# Altium schematic sheet Power Supplies.SchDoc: Power Supplies
size 431 x 279 mm; DrawnBy: DD; DocumentNumber: GHL-1-21002; Revision: C; SheetNumber: 5; SheetTotal: 7; ProjectID: 263-03
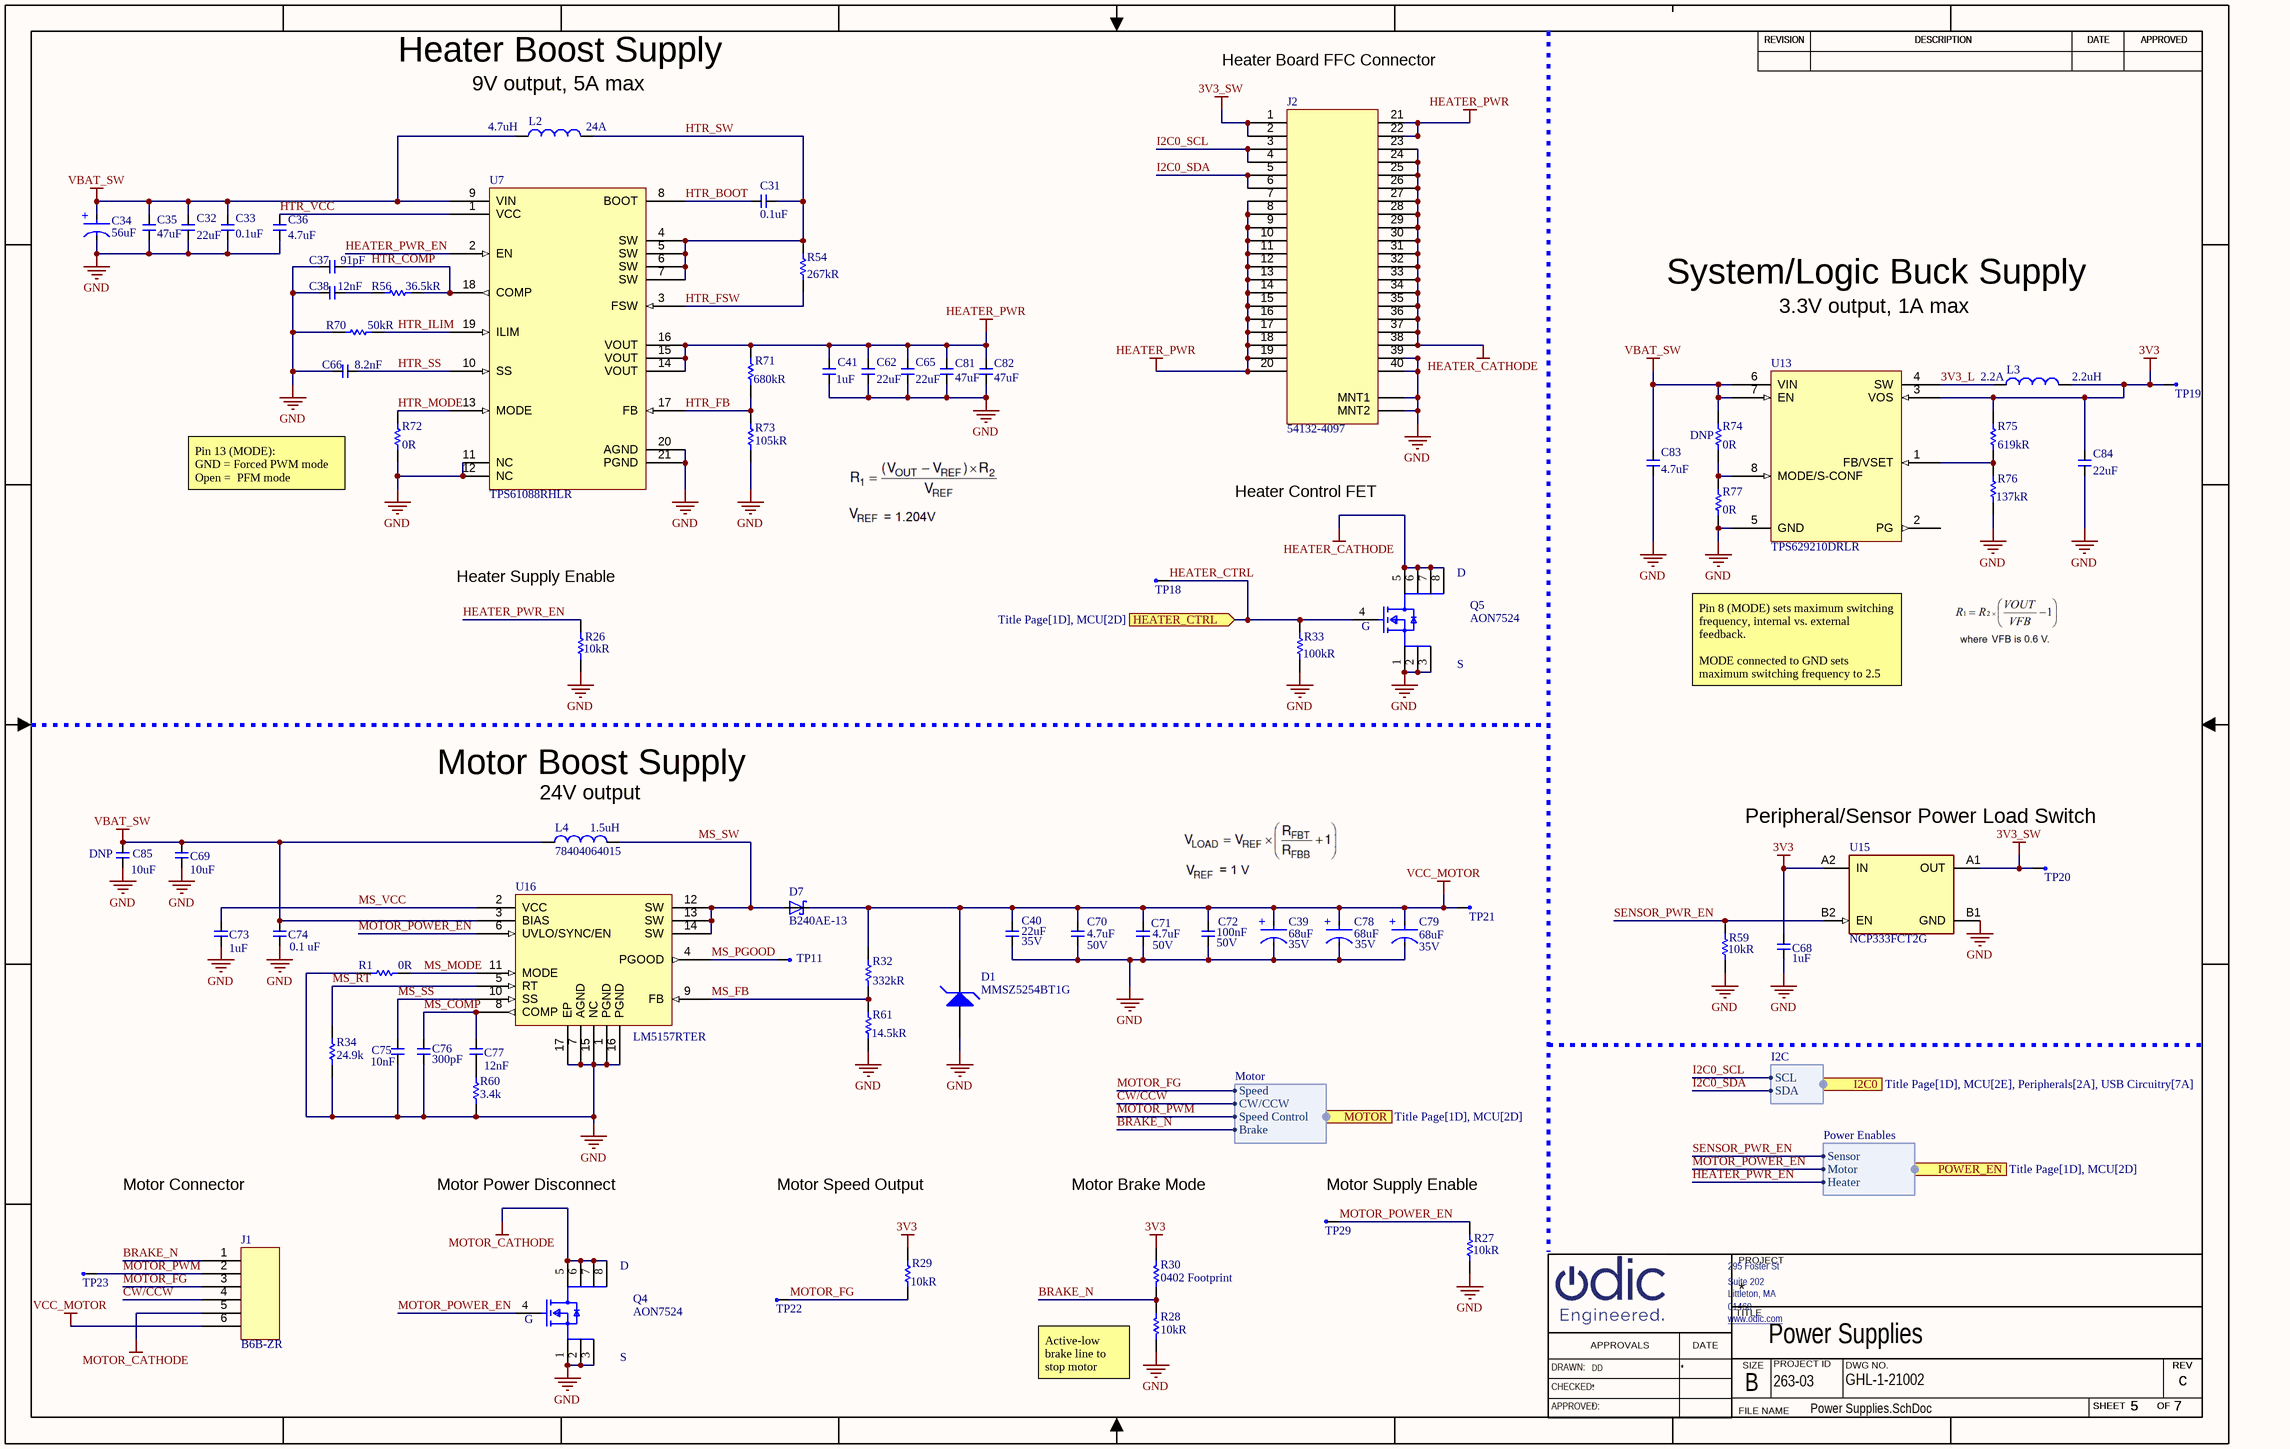
[diagram p0: Power Supplies.SchDoc]

## Parts
C31  0.1uF  [C0402]
C32  value 22uF  [C1206]  (hidden comment: C1206_22u_16C_10pct)
C33  0.1uF  [C0402]
C34  value 56uF  [cap_panasonic_svpf_code-b6]  (hidden comment: 20SVPF56MX)
C35  value 47uF  [C1210]  (hidden comment: C1210_47u_16V_10pct)
C36  4.7uF  [C0402]
C37  value 91pF  [C0402]  (hidden comment: C0402_91p_50V_5pct)
C38  value 12nF  [C0402]  (hidden comment: C0402_12n_16V_10pct)
C39  value 68uF  Voltage Rating: 35V  [C7361-38]  (hidden comment: TAJV686M035RNJ)
C40  value 22uF  Voltage Rating: 35V  [c0805]  (hidden comment: C0805_22u_35V_20pct)
C41  Capacitance: 1uF  [C0603]  (hidden comment: C0603_1u_25V_10pct)
C62  value 22uF  [C1206]  (hidden comment: C1206_22u_16C_10pct)
C65  value 22uF  [C1206]  (hidden comment: C1206_22u_16C_10pct)
C66  value 8.2nF  [C0402]  (hidden comment: C0402_8n2_16V_10pct)
C68  Capacitance: 1uF  [C0402]  (hidden comment: C0402_1u_6V3_10pct)
C69  10uF  [C0603]
C70  value 4.7uF  Voltage Rating: 50V  [c0805]  (hidden comment: C0805_4u7_50V_10pct)
C71  value 4.7uF  Voltage Rating: 50V  [c0805]  (hidden comment: C0805_4u7_50V_10pct)
C72  100nF  Voltage Rating: 50V  [C0603]
C73  1uF  [C0603]
C74  Capacitance: 0.1 uF  [c0805]  (hidden comment: C0805_0u1_25V_10pct)
C75  value 10nF  [C0402]  (hidden comment: C0402_10n_35V_10pct)
C76  value 300pF  [C0402]  (hidden comment: C0402_300p_50V_5pct)
C77  12nF  [C0402]
C78  value 68uF  Voltage Rating: 35V  [C7361-38]  (hidden comment: TAJV686M035RNJ)
C79  value 68uF  Voltage Rating: 35V  [C7361-38]  (hidden comment: TAJV686M035RNJ)
C81  value 47uF  [C1210]  (hidden comment: C1210_47u_16V_10pct)
C82  value 47uF  [C1210]  (hidden comment: C1210_47u_16V_10pct)
C83  value 4.7uF  [c0805]  (hidden comment: C0805_4u7_16V_10pct)
C84  Capacitance: 22uF  [C0603]  (hidden comment: C0603_22u_6V3_20pct)
C85  10uF  Install: DNP  [C0603]
D1  MMSZ5254BT1G  [sod123]
D7  B240AE-13  [sma]
J1  B6B-ZR  [jst-b6b-zr]
J2  54132-4097  [molex_54132-4097]
L2  value 4.7uH  Saturation Current: 24A  [ind2_vishay_ihlp5050ce]  (hidden comment: IHLP5050CEER4R7M01)
L3  Inductance: 2.2uH  Current Rating: 2.2A  [ind2_2520]  (hidden comment: DFE252012PD-2R2M=P2)
L4  78404064015  value 1.5uH  [ind2_wurth_78404064015]
Q4  AON7524  [dfn8_3x3_p65mm_fet]
Q5  AON7524  [dfn8_3x3_p65mm_fet]
R1  0R  [R0402]
R26  Resistance: 10kR  [R0402]  (hidden comment: R0402_10k_1pct)
R27  Resistance: 10kR  [R0402]  (hidden comment: R0402_10k_1pct)
R28  Resistance: 10kR  [R0402]  (hidden comment: R0402_10k_1pct)
R29  Resistance: 10kR  [R0402]  (hidden comment: R0402_10k_1pct)
R30  0402 Footprint  [R0402]  (no BOM)
R32  value 332kR  [R0402]  (hidden comment: R0402_332k_1pct)
R33  Resistance: 100kR  [R0402]  (hidden comment: R0402_100k_1pct)
R34  24.9k  [R0402]
R54  value 267kR  [R0402]  (hidden comment: R0402_267k_1pct)
R56  value 36.5kR  [R0402]  (hidden comment: R0402_36k5_1pct)
R59  Resistance: 10kR  [R0402]  (hidden comment: R0402_10k_1pct)
R60  3.4k  [R0402]
R61  value 14.5kR  [R0402]  (hidden comment: R0402_14k5_1pct)
R70  value 50kR  [R0402]  (hidden comment: R0402_50k_1pct)
R71  value 680kR  [R0402]  (hidden comment: R0402_680k_1pct)
R72  Resistance: 0R  [R0402]  (hidden comment: R0402_0R)
R73  value 105kR  [R0402]  (hidden comment: R0402_105k_1pct)
R74  Install: DNP  Resistance: 0R  [R0402]  (hidden comment: R0402_0R)
R75  value 619kR  [R0402]  (hidden comment: R0402_619k_1pct)
R76  value 137kR  [R0402]  (hidden comment: R0402_137k_1pct)
R77  Resistance: 0R  [R0402]  (hidden comment: R0402_0R)
TP11  TPC30  [tpc30]  (value not drawn)
TP18  TPC30  [tpc30]  (value not drawn)
TP19  TPC30  [tpc30]  (value not drawn)
TP20  TPC30  [tpc30]  (value not drawn)
TP21  TPC30  [tpc30]  (value not drawn)
TP22  TPC30  [tpc30]  (value not drawn)
TP23  TPC30  [tpc30]  (value not drawn)
TP29  TPC30  [tpc30]  (value not drawn)
U7  TPS61088RHLR  [qfn20_3p5x4p5_p5mm]
U13  TPS629210DRLR  [SOT-583]
U15  NCP333FCT2G  [bga4_p743xp743_p4mm]
U16  LM5157RTER  [qfn16_3x3_p5mm_thpad]

## Ports
HEATER_CTRL (in, see Title Page[1D], MCU[2D]), I2C0 (harness I2C, see Title Page[1D], MCU[2E], Peripherals[2A], USB Circuitry[7A]), MOTOR (harness Motor, see Title Page[1D], MCU[2D]), POWER_EN (harness Power Enables, see Title Page[1D], MCU[2D])

## Harnesses
Power Enables: Sensor, Motor, Heater
I2C: SCL, SDA
Motor: Speed, CW/CCW, Speed Control, Brake

## Nets
3V3: C68.2 C84.2 L3.2 R29.2 R30.1 R75.2 TP19.1 U13.3(VOS) U15.A2(IN)
3V3_SW: J2.1 J2.2 TP20.1 U15.A1(OUT)
GND: C32.1 C33.2 C34.2 C35.1 C36.1 C37.1 C38.1 C39.2 C40.1 C41.1 C62.1 C65.1 C66.1 C68.1 C69.1 C70.1 C71.1 C72.1 C73.1 C74.1 C75.1 C76.1 C78.2 C79.2 C81.1 C82.1 C83.1 C84.1 C85.1 D1.A J2.39 J2.40 J2.MNT1 J2.MNT2 Q4.1(S) Q4.2(S) Q4.3(S) Q5.1(S) Q5.2(S) Q5.3(S) R1.1 R26.2 R27.2 R28.2 R33.1 R34.1 R59.2 R60.1 R61.1 R70.1 R72.1 R73.1 R76.1 R77.1 U7.11(NC) U7.12(NC) U7.20(AGND) U7.21(PGND) U13.5(GND) U15.B1(GND) U16.1(PGND) U16.7(AGND) U16.15(NC) U16.16(PGND) U16.17(EP)
HEATER_CATHODE: J2.23 J2.24 J2.25 J2.26 J2.27 J2.28 J2.29 J2.30 J2.31 J2.32 J2.33 J2.34 J2.35 J2.36 J2.37 J2.38 Q5.5(D) Q5.6(D) Q5.7(D) Q5.8(D)
HEATER_PWR: C41.2 C62.2 C65.2 C81.2 C82.2 J2.7 J2.8 J2.9 J2.10 J2.11 J2.12 J2.13 J2.14 J2.15 J2.16 J2.17 J2.18 J2.19 J2.20 J2.21 J2.22 R71.2 U7.14(VOUT) U7.15(VOUT) U7.16(VOUT)
MOTOR_CATHODE: J1.5 Q4.5(D) Q4.6(D) Q4.7(D) Q4.8(D)
VBAT_SW: C32.2 C33.1 C34.1 C35.2 C69.2 C74.2 C83.2 C85.2 L2.1 L4.1 R74.2 U7.9(VIN) U13.6(VIN) U13.7(EN) U16.3(BIAS)
VCC_MOTOR: C39.1 C40.2 C70.2 C71.2 C72.2 C78.1 C79.1 D1.K D7.K J1.6 R32.2 TP21.1
3V3_L: L3.1 U13.4(SW)
BRAKE_N: J1.1 R28.1 R30.2 ; port MOTOR.Brake
CW/CCW: J1.4 ; port MOTOR.CW/CCW
HEATER_CTRL: Q5.4(G) R33.2 TP18.1 ; port HEATER_CTRL
HEATER_PWR_EN: R26.1 U7.2(EN) ; port POWER_EN.Heater
HTR_BOOT: C31.2 U7.8(BOOT)
HTR_COMP: C37.2 R56.2 U7.18(COMP)
HTR_FB: R71.1 R73.2 U7.17(FB)
HTR_FSW: R54.1 U7.3(FSW)
HTR_ILIM: R70.2 U7.19(ILIM)
HTR_MODE: R72.2 U7.13(MODE)
HTR_SS: C66.2 U7.10(SS)
HTR_SW: C31.1 L2.2 R54.2 U7.4(SW) U7.5(SW) U7.6(SW) U7.7(SW)
HTR_VCC: C36.2 U7.1(VCC)
I2C0_SCL: J2.3 J2.4 ; port I2C0.SCL
I2C0_SDA: J2.5 J2.6 ; port I2C0.SDA
MOTOR_FG: J1.3 R29.1 TP22.1 ; port MOTOR.Speed
MOTOR_POWER_EN: Q4.4(G) R27.1 TP29.1 U16.6(UVLO/SYNC/EN) ; port POWER_EN.Motor
MOTOR_PWM: J1.2 TP23.1 ; port MOTOR.Speed Control
MS_COMP: C76.2 C77.2 U16.8(COMP)
MS_FB: R32.1 R61.2 U16.9(FB)
MS_MODE: R1.2 U16.11(MODE)
MS_PGOOD: TP11.1 U16.4(PGOOD)
MS_RT: R34.2 U16.5(RT)
MS_SS: C75.2 U16.10(SS)
MS_SW: D7.A L4.2 U16.12(SW) U16.13(SW) U16.14(SW)
MS_VCC: C73.2 U16.2(VCC)
SENSOR_PWR_EN: R59.1 U15.B2(EN) ; port POWER_EN.Sensor
NetC38_2: C38.2 R56.1
NetC77_1: C77.1 R60.2
NetR74_1: R74.1 R77.2 U13.8(MODE/S-CONF)
NetR75_1: R75.1 R76.2 U13.1(FB/VSET)

Not connected (* = marked no-connect by the designer): U13 2(PG)

## Notes on the sheet
- Heater Boost Supply
- (near L2) 9V output, 5A max
- Heater Board FFC Connector
- System/Logic Buck Supply
- 3.3V output, 1A max
- Pin 13 (MODE):
  GND = Forced PWM mode
  Open =  PFM mode
- Heater Control FET
- (near R26) Heater Supply Enable
- Pin 8 (MODE) sets maximum switching frequency, internal vs. external feedback.
  MODE connected to GND sets maximum switching frequency to 2.5 MHz (variable), and external feedback
- Motor Boost Supply
- (near L4) 24V output
- Peripheral/Sensor Power Load Switch
- Motor Connector
- Motor Power Disconnect
- Motor Speed Output
- Motor Brake Mode
- Motor Supply Enable
- (near R28) Active-low brake line to stop motor
- REVISION
- DESCRIPTION
- DATE
- APPROVED
- 295 Foster St
- PROJECT
- www.odic.com <http://www.odic.com>
- Littleton, MA
- 01460
- Suite 202
- TITLE
- DRAWN:
- CHECKED:
- APPROVALS
- SIZE
- B
- PROJECT ID
- DWG NO.
- SHEET
- OF
- REV
- APPROVED:
- FILE NAME
- (in symbol CMP-00961-2) +
- (in symbol CMP-00978-3) +

## Library data of the parts
C31 C33 = CMP-00446-1: Ceramic capacitor SMD 0402 100nF 16V X7R 10%; Install: POP; Voltage: 16V; Mounting Technology: Surface Mount; Width: 0.02inch; Case Code (Metric): 1005; Package Quantity: 1; Depth: 0.5mm; RoHS Compliant: Yes; Length: 1mm; Tolerance: 10%; Value: 100nF; Radiation Hardening: No; Contact Plating: Tin; Packaging: Tape and Reel; Voltage Rating (DC): 16V; Thickness: 0.022inch; Case Code (Imperial): 0402; Case/Package: 0402; Min Operating Temperature: -55°C; Max Operating Temperature: 125°C; Voltage Rating: 16V; Height: 0.5mm; Series: CL; Material: Ceramic; Construction: Flat; Lead Free: Lead Free; Dielectric: X7R
C32 C62 C65 = CMP-00980-4: 1206 22 uF 16 V ±10% Tolerance X5R SMT Multilayer Ceramic Capacitor; Voltage: 16V; Install: POP; Radiation Hardening: No; Package Quantity: 1; Height: 1.6mm; Pins: 2; Voltage Rating (DC): 16V; Min Operating Temperature: -55°C; Depth: 1.6mm; Reach SVHC Compliant: No; Thickness: 0.071inch; Case Code (Metric): 3216; Packaging: Tape and Reel; Termination: SMD/SMT; Dielectric: X5R; Case/Package: 1206; Lead Free: Lead Free; Case Code (Imperial): 1206; Tolerance: 10%; Material: Ceramic; Width: 1.6mm; Mounting Technology: Surface Mount; RoHS Compliant: Yes; Series: GRM; Max Operating Temperature: 85°C; Voltage Rating: 16V; Construction: Flat; Length: 3.2mm
C34 = CMP-00978-3: Cap Aluminum Polymer 56uF 20VDC 20%( 5 X 5.9mm) SMD 0.03 Ohm 2800mA 5000h 105C T/R; ESR (Equivalent Series Resistance): 30mR; Voltage Rating: 20V; Ripple Current: 2.8A; Life (Hours): 5000Hour; Leakage Current: 224uA; Dissipation Factor: 12%; Install: POP; Package Quantity: 1500; Height: 5.9mm; Max Operating Temperature: 105°C; Min Operating Temperature: -55°C; Ripple Current (AC): 2.8A; Series: OS-CON™, SVPF; Diameter: 5mm; Reach SVHC Compliant: No; Voltage Rating (DC): 20V; Mounting Technology: Surface Mount; RoHS Compliant: Yes; Case/Package: Radial; Termination: SMD/SMT; Pins: 6; Packaging: Tape and Reel; Length: 5.9mm; Voltage: 20V; Tolerance: 20%
C35 C81 C82 = CMP-00979-3: Multilayer Ceramic Capacitor, 47 uF, 16 V, 10%, X5R, 1210 [3225 Metric]; Voltage Rating: 16V; Install: POP; Packaging: Cut Tape; Series: CL; RoHS Compliant: Yes; Min Operating Temperature: -55°C; Max Operating Temperature: 85°C; Dielectric: X5R; Thickness: 0.106inch; Height: 2.8mm; Length: 0.126inch; Tolerance: 10%; Lead Free: Lead Free; Case/Package: 1210; Case Code (Imperial): 1210; Material: Ceramic; Package Quantity: 1; Width: 0.098inch; Case Code (Metric): 3225; Voltage Rating (DC): 16V; Mounting Technology: Surface Mount
C36 = CMP-00316-1: Cap Ceramic 4.7uF 10V X5R 20% SMD 0402 85°C Paper T/R; Install: POP; Width: 0.02inch; Package Quantity: 10000; Min Operating Temperature: -55°C; Mount: Surface Mount; Case Code (Imperial): 0402; Case/Package: 0402; Capacitance: 4.7uF; Series: CL; Packaging: Cut Tape; Length: 0.039inch; Dielectric: X5R; Voltage Rating: 10V; Thickness: 0.022inch; Tolerance: 20%; Max Operating Temperature: 85°C; RoHS Compliant: Yes; Case Code (Metric): 1005; Lead Free: Lead Free
C37 = CMP-00987-3: Multilayer Ceramic Capacitors MLCC - SMD/SMT 50V 91pF C0G 0402 5%; Install: POP; Mounting Technology: Surface Mount; Case Code (Imperial): 0402; Series: CC; Thickness: 0.022inch; Min Operating Temperature: -55°C; Voltage Rating (DC): 50V; Halogen Free: Halogen Free; Case/Package: 0402; Lead Free: Lead Free; Packaging: Cut Tape; Max Operating Temperature: 125°C; Case Code (Metric): 1005; Length: 0.039inch; Width: 0.02inch; Voltage Rating: 50V; Tolerance: 5%
C38 C77 = CMP-001-00029-1: 0402 12 nF 16 V ±10% Tolerance X7R SMT Multilayer Ceramic Capacitor; Voltage: 16V; Install: POP; Case Code (Metric): 1005; Width: 0.5mm; Dielectric: X7R; Case Code (Imperial): 0402; Packaging: Tape and Reel; Voltage Rating: 16V; Pins: 2; RoHS Compliant: Yes; Lead Free: Lead Free; Mounting Technology: Surface Mount; Depth: 0.5mm; Material: Ceramic; Series: GRM; Voltage Rating (DC): 16V; Package Quantity: 1; Thickness: 0.022inch; Radiation Hardening: No; Min Operating Temperature: -55°C; Max Operating Temperature: 125°C; Length: 1mm; Termination: SMD/SMT; Tolerance: 10%; Case/Package: 0402; Construction: Flat; Height: 0.5mm
  C77: Value: 12nF
C39 C78 C79 = CMP-00961-2: Cap Tant Solid 68uF 35V V CASE 20% (7.3 X 6.1 X 3.45mm) SMD 7361-38 0.5 Ohm 125AHA T/R; Leakage Current: 23.8uA; Dissipation Factor: 6%; Polarity: Polar; ESR (Equivalent Series Resistance): 500mR; Dielectric Material: Tantalum; RoHS Compliant: Yes; Case Code (Metric): 7361; Min Operating Temperature: -55°C; Max Operating Temperature: 125°C; Depth: 6.1mm; Height - Seated (Max): 0.148inch; Lead Free: Lead Free; Case Code (Imperial): 2924; Package Quantity: 400; Mounting Technology: Surface Mount; Tolerance: 20%; Voltage Rating (DC): 35V; Radiation Hardening: No; Width: 6.1mm; Series: TAJ; Case/Package: 2924; Construction: Flat; Packaging: Tape and Reel; Reach SVHC Compliant: No; Features: General Purpose; Height: 3.8mm; Length: 7.3mm; Termination: SMD/SMT
C40 = CMP-00959-2: Multilayer Ceramic Capacitor, 22 uF, 35 V, ± 20%, X5R, 0805 [2012 Metric]; Series: C; Package Quantity: 1; Max Operating Temperature: 85°C; Thickness: 0.057inch; Packaging: Tape and Reel; Lead Free: Lead Free; Height: 1.25mm; Dielectric Material: Ceramic; Case Code (Imperial): 0805; Dielectric: X5R; Reach SVHC Compliant: No; Case/Package: 0805; Length: 0.079inch; Termination: SMD/SMT; Weight: 0.000194oz; Voltage Rating (DC): 35V; Width: 0.049inch; Mounting Technology: Surface Mount; Case Code (Metric): 2012; Material: Ceramic; RoHS Compliant: Yes; Min Operating Temperature: -55°C; Tolerance: 20%
C41 = CMP-00349-2: Multilayer Ceramic Capacitors (High dielectric type), 25V, 1 uF, ± 10 %, 0603, X5R/B, RoHS; Install: POP; Tolerance: 10%; Dielectric: X5R; Min Operating Temperature: -55°C; Max Operating Temperature: 85°C; Contact Plating: Nickel; Package Quantity: 4000; Height: 0.8mm; Width: 0.8mm; Lead Free: Lead Free; Termination: SMD/SMT; Case Code (Metric): 1608; RoHS Compliant: Yes; Mount: Surface Mount; Resistor Type: Ceramic; Thickness: 0.035inch; REACH SVHC: No SVHC; Construction: Flat; Length: 1.6mm; Case/Package: 0603; Depth: 0.8mm; Packaging: Tape and Reel; Radiation Hardening: No; Number of Pins: 2; Voltage Rating (DC): 25V; Voltage Rating: 25V; Series: M; Voltage: 25V; Case Code (Imperial): 0603; Halogen Free: Halogen Free
C66 = CMP-00984-2: 0402 8.2 nF 16 V ±10% Tolerance X7R SMT Multilayer Ceramic Capacitor; Voltage Rating: 16V; Install: POP; Series: GRM; Termination: SMD/SMT; Min Operating Temperature: -55°C; Length: 1mm; Packaging: Tape and Reel; Width: 0.02inch; Case/Package: 0402; Package Quantity: 1; Dielectric: X7R; Case Code (Metric): 1005; Case Code (Imperial): 0402; Max Operating Temperature: 125°C; RoHS Compliant: Yes; Tolerance: 10%; Height: 0.5mm; Voltage Rating (DC): 16V; Depth: 0.5mm; Lead Free: Lead Free; Thickness: 0.022inch; Construction: Flat; Radiation Hardening: No; Mounting Technology: Surface Mount
C68 = CMP-00342-1: Cap Ceramic 1uF 6.3V X5R 10% SMD 0402 85C Paper T/R; Install: POP; Max Operating Temperature: 85°C; RoHS Compliant: Yes; Number of Pins: 2; Packaging: Tape and Reel; Thickness: 0.022inch; Lead Free: Lead Free; Package Quantity: 10000; Tolerance: 10%; Height: 0.5mm; Depth: 0.5mm; Construction: Flat; Radiation Hardening: No; REACH SVHC: No SVHC; Dielectric: X5R; Resistor Type: Ceramic; Min Operating Temperature: -55°C; Series: M; Width: 0.5mm; Case/Package: 0402; Voltage Rating: 6.3V; Case Code (Imperial): 0402; Length: 1mm; Voltage Rating (DC): 6.3V; Halogen Free: Halogen Free; Termination: SMD/SMT; Mount: Surface Mount; Case Code (Metric): 1005
C69 = CMP-00294-2: Cap Ceramic 10uF 35V X5R 20% Pad SMD 0603 85C T/R; Install: POP; Case Code (Metric): 1608; Length: 0.063inch; Case Code (Imperial): 0603; Thickness: 0.039inch; Width: 0.031inch; RoHS Compliant: Yes; Voltage Rating: 35V; Dielectric: X5R; Series: GRM; Case/Package: 0603; Voltage Rating (DC): 35V; Mount: Surface Mount; Capacitance: 10uF; Tolerance: 20%; Max Operating Temperature: 85°C; Packaging: Cut Tape; Min Operating Temperature: -55°C
C70 C71 = CMP-001-00030-2: Multilayer Ceramic Capacitor, 4.7 uF, 50 V, ± 10%, X5R, 0805 [2012 Metric]; Install: POP; Thickness: 0.055inch; Case/Package: 0805; Tolerance: 10%; Max Operating Temperature: 85°C; Depth: 1.25mm; Package Quantity: 1; Voltage Rating (DC): 50V; Min Operating Temperature: -55°C; Length: 2mm; Case Code (Metric): 2012; Width: 0.049inch; Packaging: Tape and Reel; Dielectric: X5R; RoHS Compliant: Yes; Mounting Technology: Surface Mount; Case Code (Imperial): 0805; Radiation Hardening: No; Material: Ceramic; Series: CL
C72 = CMP-00293-3: CAP CER 0.1UF 50V X7R 0603; Tolerance: 10%; Install: POP; Termination: Wraparound; Length: 0.063inch; Dielectric: X7R; RoHS Compliant: Yes; Case Code (Metric): 1608; Packaging: Cut Tape; Max Operating Temperature: 125°C; Mount: Surface Mount; Case Code (Imperial): 0603; Capacitance: 100nF; Thickness: 0.035inch; Width: 0.031inch; Series: CL; Construction: Flat; Case/Package: 0603; Contact Plating: Tin; Package Quantity: 1; Min Operating Temperature: -55°C
C73 = CMP-00296-2: CAP CER 1UF 16V X5R 0603; Tolerance: 10%; Install: POP; Material: Ceramic; Length: 1.6mm; Packaging: Tape and Reel; Width: 0.031inch; Voltage Rating: 16V; Construction: Flat; Package Quantity: 1; RoHS Compliant: Yes; Series: CL; Thickness: 0.035inch; Capacitance: 1uF; Min Operating Temperature: -55°C; Case/Package: 0603; Height: 0.8mm; Lead Free: Lead Free; Dielectric: X5R; Depth: 0.8mm; Radiation Hardening: No; Contact Plating: Tin; Voltage: 16V; Mount: Surface Mount; Voltage Rating (DC): 16V; Case Code (Metric): 1608; Max Operating Temperature: 85°C; Case Code (Imperial): 0603
C74 = CMP-00748-3: Cap Cer 0.1UF 25V X7R 0805; Tolerance: 10%; Maximum Voltage: 25V
C75 = CMP-00724-2: Multilayer Ceramic Capacitor, 0.01 uF, 35 V, ± 10%, X7R, 0402 [1005 Metric]; Voltage Rating (DC): 35V; Install: POP; Packaging: Tape and Reel; Voltage Rating: 35V; Height: 0.5mm; Package Quantity: 1; Max Operating Temperature: 125°C; Length: 1mm; Width: 0.02inch; RoHS Compliant: Yes; Case/Package: 0402; Weight: 2.3E-05oz; Thickness: 0.022inch; Reach SVHC Compliant: No; Tolerance: 10%; Min Operating Temperature: -55°C; Mounting Technology: Surface Mount; Termination: SMD/SMT; Case Code (Metric): 1005; Dielectric: X7R; Series: CGA; Case Code (Imperial): 0402; Depth: 0.5mm; Ratings: AEC-Q200
C76 = CMP-00937-2: Cap Ceramic 300pF 50V C0G 5% SMD 0402 125°C Paper T/R; Case Code (Metric): 1005; Min Operating Temperature: -55°C; Max Operating Temperature: 125°C; Pins: 2; Voltage Rating: 50V; Material: Ceramic; Series: SMD Comm C0G; Tolerance: 5%; Voltage Rating (DC): 50V; RoHS Compliant: Yes; Lead Free: Lead Free; Packaging: Cut Tape; Case/Package: 0402; Dielectric Material: Ceramic; Case Code (Imperial): 0402
C83 = CMP-00975-2: Multilayer Ceramic Capacitor, 4.7 uF, 16 V, ± 10%, X5R, 0805 [2012 Metric]; Voltage: 16V; Install: POP; Package Quantity: 3000; Case/Package: 0805; Case Code (Imperial): 0805; Packaging: Cut Tape; Case Code (Metric): 2012; Width: 0.049inch; Min Operating Temperature: -55°C; Tolerance: 10%; Mounting Technology: Surface Mount; Series: CL; Voltage Rating: 16V; Lead Free: Lead Free; Length: 0.079inch; Height: 1.25mm; Material: Ceramic; Depth: 1.25mm; Max Operating Temperature: 85°C; Dielectric: X5R; RoHS Compliant: Yes; Thickness: 0.053inch; Voltage Rating (DC): 16V
C84 = CMP-00371-1: CAP CER 22UF 6.3V X5R 0603; Material: Ceramic; Tolerance: 20%; Install: POP; Min Operating Temperature: -55°C; Mount: Surface Mount; Depth: 0.8mm; Packaging: Tape and Reel; Construction: Flat; Width: 0.031inch; Radiation Hardening: No; Thickness: 0.039inch; Length: 1.6mm; Contact Plating: Tin; Height: 0.8mm; Dielectric: X5R; Case Code (Metric): 1608; Max Operating Temperature: 85°C; RoHS Compliant: Yes; Voltage Rating: 6.3V; Case Code (Imperial): 0603; Case/Package: 0603; Package Quantity: 1; Voltage: 6.3V; Series: CL
C85 = CMP-00294-2: Cap Ceramic 10uF 35V X5R 20% Pad SMD 0603 85C T/R; Case Code (Metric): 1608; Length: 0.063inch; Case Code (Imperial): 0603; Thickness: 0.039inch; Width: 0.031inch; RoHS Compliant: Yes; Voltage Rating: 35V; Dielectric: X5R; Series: GRM; Case/Package: 0603; Voltage Rating (DC): 35V; Mount: Surface Mount; Capacitance: 10uF; Tolerance: 20%; Max Operating Temperature: 85°C; Packaging: Cut Tape; Min Operating Temperature: -55°C
D1 = CMP-00963-2: MMSZ5254BT1G Zener Diode, 27V 5% 500 mW SMT 2-Pin SOD-123; Power Rating: 500mW; Material: Plastic; Peak Pulse Current: 1.9A; Min Breakdown Voltage: 14.25V; Impedance: 41R; Test Current: 4.6mA; Zener Current: 10mA; Reverse Standoff Voltage: 12V; Max Reverse Leakage Current: 100nA; Forward Voltage: 900mV; Polarity: Unidirectional; Max Breakdown Voltage: 15.75V; Length: 2.84mm; Termination: SMD/SMT; Case/Package: SOD-123-2; Reach SVHC Compliant: No; Packaging: Tape and Reel; Zener Voltage: 27V; Max Power Dissipation: 500mW; Pins: 2; Voltage Tolerance: 5%; Package Quantity: 3000; Tolerance: 5%; Breakdown Voltage: 14.25V; Power Dissipation: 500mW; Voltage Rating (DC): 27V; Max Operating Temperature: 150°C; Lead Free: Lead Free; Diode Type: ZENER; Series: -; Max Reverse Current: 100nA; RoHS Compliant: Yes; Height: 1.25mm; Radiation Hardening: No; Width: 1.8mm; Min Operating Temperature: -55°C; Working Voltage: 27V
D7 = CMP-004-00003-5: Diode Schottky 40V 2A 2-Pin DO-214AC T/R; Install: POP; Case/Package: SMA; Average Rectified Current: 2A; Mount: Surface Mount; Packaging: Tape and Reel; RoHS Compliant: Yes; Max Reverse Voltage (DC): 40V
J1 = CMP-00968-2: Header B6B-ZR, 1.50mm, 6-contacts, top entry, THT, /2000/box; Contact Resistance: 20mR; Pitch: 0.059inch; Gender: Male; Current Rating: 1A; Insulation Resistance: 500MR; Number of Positions: 6; Test Voltage: 500V; Contact Type: Male Pin; Packaging: Bulk; Series: ZH; Contact Plating: Tin,Lead; Color: Natural; Mounting Technology: Through Hole; Contact Material: Bronze,Tin; Orientation: Vertical; Contact Mating Length: 0.094inch; Lead Free: Contains Lead; Package Quantity: 2000; Housing Color: Natural; Fastening Type: Detent; Termination: Press-Fit; Number of Contacts: 6; Number of Rows: 1; Housing Material: Nylon
J2 = CMP-00970-3: .50MM Ffc/fpc Connectors 40CKT R/a SMT Zif Botton Contact; Voltage Rating (DC): 50V; Number of Contacts: 40; Gender: Receptacle; Pitch: 0.5mm; Contact Location: Bottom; Insulation Resistance: 50MR; Actuator Material: Polyphenylene; Current Rating: 500mA; Contact Resistance: 20mR; Wire/Cable Type: Straight; Number of Rows: 1; Contact Plating: Tin; Mounting Technology: Surface Mount; Packaging: Tape and Reel; Contact Material: Bronze; RoHS Compliant: Yes; Length: 25.5mm; Max Operating Temperature: 85°C; Package Quantity: 1; Number of Positions: 40; Radiation Hardening: No; Flammability Rating: UL94 V-0; Housing Material: Nylon; Termination: Solder; Housing Color: Black; Orientation: Right Angle; Lead Pitch: 0.5mm; Voltage Rating: 50V; Depth: 5.6mm; Series: 54132; Lead Free: Lead Free; Min Operating Temperature: -20°C
L2 = CMP-00976-3: Inductor Power Shielded Wirewound 4.7uH 20% 100KHz Powdered Iron 10A 15mOhm DCR 5050 T/R; Self Resonant Frequency: 5MHz; Inductor Type: HIGH FREQUENCY; Core Material: Metal,Composite,Ferrite; ESR: 15mR; Install: POP; Lead Free: Lead Free; Termination: SMD/SMT; Width: 12.9mm; Shielding: Shielded; Case/Package: 5050; Test Frequency: 100kHz; Depth: 12.9mm; Pins: 5050; Length: 13.2mm; Tolerance: 20%; RMS Current (Irms): 10A; Package Quantity: 500; Inductance Tolerance: 20%; Mounting Technology: Surface Mount; Radiation Hardening: No; Max Operating Temperature: 125°C; Reach SVHC Compliant: Unknown; Packaging: Tape and Reel; Military Standard: Not; DC Resistance (DCR): 15mR; Height: 3.5mm; RoHS Compliant: Yes; Min Operating Temperature: -55°C; Max DC Current: 10A; Current Rating: 10A; Max Current Rating: 10A; Series: IHLP-5050CE-01
L3 = CMP-00972-3: Ind Power Chip Shielded Wirewound 2.2uH 20% 1MHz Metal 2.2A 1008 Emboss T/R; Tolerance: +/-20%; Saturation Current: 2.8A; DCR: 84 mOhm max; Install: POP; RoHS Compliant: Yes
L4 = CMP-00936-3: WE-LQSA SMT Semi-Shielded Power Inductor 1.5uH 6.1 A 13mOhm Max; Install: POP; Saturation Current: 9.7A; Current Rating: 6.1A
Q4 Q5 = CMP-00921-2: Trans Mosfet N-ch 30V 28A 8-PIN Dfn-a Ep; Max Power Dissipation: 32W; Input Capacitance: 2.25nF; Rds On Max: 3.3mR; Install: POP; Series: AlphaMOS; Drain to Source Voltage (Vdss): 30V; Mounting Technology: Surface Mount; Continuous Drain Current (ID): 28A; RoHS Compliant: Yes; Case/Package: DFN; Max Operating Temperature: 150°C; Packaging: Cut Tape; Min Operating Temperature: -55°C
R1 R72 R77 = CMP-00319-1: RES 0 OHM JUMPER 1/16W 0402; Max Power Dissipation: 63mW; Install: POP; Working Voltage: 50V; Current Rating: 1A; Case/Package: 0402; Max Operating Temperature: 155°C; Contact Plating: Tin,Matte; Height: 0.016inch; RoHS Compliant: Yes; Lead Free: Lead Free; Length: 0.039inch; Case Code (Imperial): 0402; Resistor Type: Thick Film; Military Standard: Not; Width: 0.02inch; Construction: Rectangular; Features: Automotive AEC-Q200; Depth: 0.5mm; Case Code (Metric): 1005; Technology: THICK FILM; Number of Terminations: 2; Power Rating: 63mW; Radiation Hardening: No; Min Operating Temperature: -55°C; Series: RMCF; Packaging: Tape and Reel; Mount: Surface Mount
  R1: Resistance: 0R
R26-R29 R59 = CMP-00352-1: Res Thick Film 0402 10K Ohm 1% 1/16W ±100ppm/°C Molded SMD SMD T/R; Max Power Dissipation: 63mW; Install: POP; RoHS Compliant: Yes; Number of Terminations: 2; Case/Package: 0402; Case Code (Metric): 1005; Length: 0.039inch; Military Standard: Not; Size Code: 0402; Series: RC; Height: 0.016inch; Contact Plating: Tin; Features: Moisture Resistant; Width: 0.02inch; Mount: Surface Mount; Temperature Coefficient: 100ppm/°C; Package Quantity: 1; Resistor Type: Thick Film; Min Operating Temperature: -55°C; Max Operating Temperature: 155°C; Power Rating: 63mW; Tolerance: 1%; Depth: 0.5mm; Case Code (Imperial): 0402; Construction: Rectangular; Packaging: Tape and Reel; Radiation Hardening: No
R30 = CMP-00015-3: Unpopulated 0402 pads. No part number associated with this "component"; Install: DNP; Odic Footprint: R0402
R32 = CMP-00966-1: Res Thick Film 0402 332K Ohm 1% 0.1W(1/10W) ±100ppm/°C Pad SMD Automotive T/R; Power Rating: 63mW; Voltage Rating: 50V; Length: 1mm; Termination: SMD/SMT; Case Code (Imperial): 0402; Max Operating Temperature: 155°C; Case/Package: 0402; Width: 0.5mm; Packaging: Tape and Reel; Height: 0.35mm; Lead Free: Lead Free; Case Code (Metric): 1005; Package Quantity: 10000; Mounting Technology: Surface Mount; RoHS Compliant: Yes; Technology: THICK FILM; Construction: Rectangular; Temperature Coefficient: 100ppm/°C; Depth: 0.5mm; Tolerance: 1%; Min Operating Temperature: -55°C; Series: RK73H; Military Standard: MIL-R-55342F; Voltage Rating (DC): 50V
R33 = CMP-00351-1: Res General Purpose Thick Film 0402 100K Ohm 1% 1/16W ±100ppm/°C Molded SMD Paper T/R; Working Voltage: 50V; Install: POP; Power Rating: 63mW; Series: RC; Military Standard: Not; Case Code (Metric): 1005; Features: Moisture Resistant; Termination: SMD/SMT; Number of Terminations: 2; Temperature Coefficient: 100ppm/°C; Height: 0.016inch; Tolerance: 1%; Case/Package: 0402; Depth: 0.5mm; RoHS Compliant: Yes; Resistance Tolerance: 1%; Lead Free: Lead Free; Max Operating Temperature: 155°C; Min Operating Temperature: -55°C; Width: 0.02inch; Packaging: Tape and Reel; Technology: THICK FILM; Case Code (Imperial): 0402; Package Quantity: 1; REACH SVHC: No SVHC; Resistor Type: Thick Film; Max Power Dissipation: 63mW; Voltage Rating: 50V; Length: 0.039inch; Construction: Rectangular
R34 = CMP-00939-1: Res Thick Film 0402 24.9K Ohm 1% 1/10W ±100ppm/|C SMD Punched Carrier T/R; Power Rating: 100mW; Voltage Rating: 50V; Temperature Coefficient: 100ppm/°C; Value: 24.9kR; Install: POP; Tolerance: 1%; Package Quantity: 1; Series: ERJ; Case/Package: 0402; Resistance Tolerance: 1%; Features: Automotive AEC-Q200; Weight: 2.8E-05oz; Construction: Rectangular; Termination: SMD/SMT; Packaging: Tape and Reel; Min Operating Temperature: -55°C; Mounting Technology: Surface Mount; Military Standard: Not; Number of Terminations: 2; Width: 0.5mm; Max Power Dissipation: 100mW; Contact Plating: Tin; Depth: 0.5mm; Case Code (Imperial): 0402; RoHS Compliant: Yes; Max Operating Temperature: 155°C; Ratings: AEC-Q200; Lead Free: Lead Free; Length: 1mm; Case Code (Metric): 1005; Reach SVHC Compliant: No; Resistor Type: Thick Film; Voltage Rating (DC): 50V; Height: 0.016inch
R54 = CMP-00981-2: Res Thick Film 0402 267K Ohm 1% 0.063W ±100ppm/°C Molded SMD Paper T/R; Max Power Dissipation: 63mW; Voltage Rating: 50V; Install: POP; RoHS Compliant: Yes; Length: 0.039inch; Min Operating Temperature: -55°C; Series: RMCF; Tolerance: 1%; Case Code (Metric): 1005; Features: Automotive AEC-Q200; Radiation Hardening: No; Contact Plating: Tin,Matte; Ratings: AEC-Q200; Mounting Technology: Surface Mount; Case/Package: 0402; Case Code (Imperial): 0402; Height: 0.016inch; Temperature Coefficient: 100ppm/°C; Width: 0.02inch; Max Operating Temperature: 155°C; Number of Terminations: 2; Packaging: Tape and Reel
R56 = CMP-00986-2: SMD Chip Resistor, 36.5 kOhm, ï¿½ 1%, 63 mW, 0402 [1005 Metric], Thick Film, General Purpose; Max Power Dissipation: 63mW; Voltage Rating (DC): 50V; Temperature Coefficient: 100ppm/°C; Power Rating: 62.5mW; Install: POP; Features: Moisture Resistant; Resistor Type: Thick Film; Width: 0.02inch; Military Standard: Not; Resistance Tolerance: 1%; Series: RC; Tolerance: 1%; Case/Package: 0402; Min Operating Temperature: -55°C; Contact Plating: Tin,Matte; Depth: 0.5mm; Packaging: Tape and Reel; Length: 0.039inch; Number of Terminations: 2; Case Code (Metric): 1005; Height: 0.016inch; Max Operating Temperature: 155°C; RoHS Compliant: Yes; Case Code (Imperial): 0402; Lead Free: Lead Free; Termination: SMD/SMT; Reach SVHC Compliant: No; Voltage Rating: 50V; Construction: Rectangular
R60 = CMP-00938-1: SMD Chip Resistor, 3.4 kOhm, ± 1%, 100 mW, 0402 [1005 Metric], Thick Film, Precision; Value: 3.4kR; Max Power Dissipation: 100mW; Temperature Coefficient: 100ppm/°C; Install: POP; Voltage Rating (DC): 50V; Ratings: AEC-Q200; Tolerance: 1%; Min Operating Temperature: -55°C; Height: 0.016inch; Number of Terminations: 2; Package Quantity: 1; Width: 0.5mm; Length: 0.039inch; Weight: 2.8E-05oz; Case Code (Imperial): 0402; Lead Free: Contains Lead; RoHS Compliant: Yes; Max Operating Temperature: 155°C; Termination: SMD/SMT; Case/Package: 0402; Features: Automotive AEC-Q200; Resistance Tolerance: 1%; Resistor Type: Thick Film; Contact Plating: Tin; Reach SVHC Compliant: No; Mounting Technology: Surface Mount; Packaging: Tape and Reel; Case Code (Metric): 1005; Series: ERJ; Power Rating: 100mW; Voltage Rating: 50V
R61 = CMP-00967-1: RN73H 0402 (1005Metric) Chip Resistor ±1% ±25ppm/C 14.5kOhm 0.063W 1/16W; Voltage Rating: 50V; Temperature Coefficient: 25ppm/°C; Power Rating: 63mW; Min Operating Temperature: -55°C; Case/Package: 0402; Voltage Rating (DC): 50V; Packaging: Tape and Reel; Tolerance: 1%; Termination: SMD/SMT; Case Code (Imperial): 0402; Max Operating Temperature: 155°C; Case Code (Metric): 1005; Series: RN73H
R70 = CMP-00985-2: Fixed Resistor, Metal Glaze/thick Film, 0.063W, 50000ohm, 50V, 1% +/-Tol, 100ppm/Cel, Surface Mount, 0402; Temperature Coefficient: 100ppm/°C; Power Rating: 63mW; Install: POP; Termination: SMD/SMT; Width: 0.5mm; Tolerance: 1%; Lead Free: Lead Free; Voltage Rating: 50V; Package Quantity: 10000; Max Operating Temperature: 155°C; Min Operating Temperature: -55°C; RoHS Compliant: Yes; Length: 1mm; Case Code (Imperial): 0402; Case/Package: 0402; Case Code (Metric): 1005; Series: CRCW; Packaging: Tape and Reel; Height: 0.35mm; Weight: 2.3E-05oz
R71 = CMP-00982-2: Res Thick Film 0402 680K Ohm 1% 1/16W ±100ppm/°C Molded SMD SMD Paper T/R; Voltage Rating: 50V; Max Power Dissipation: 63mW; Install: POP; Max Operating Temperature: 155°C; Contact Plating: Tin,Matte; Ratings: AEC-Q200; Case/Package: 0402; Radiation Hardening: No; Temperature Coefficient: 100ppm/°C; Case Code (Imperial): 0402; Height: 0.016inch; Min Operating Temperature: -55°C; Packaging: Tape and Reel; Mounting Technology: Surface Mount; Number of Terminations: 2; Tolerance: 1%; Length: 0.039inch; Series: RMCF; Case Code (Metric): 1005; RoHS Compliant: Yes; Width: 0.02inch; Features: Automotive AEC-Q200
R73 = CMP-00983-2: SMD Chip Resistor, 105 kOhm, ± 1%, 63 mW, 0402 [1005 Metric], Thick Film, General Purpose; Voltage Rating: 50V; Power Rating: 62.5mW; Max Power Dissipation: 63mW; Temperature Coefficient: 100ppm/°C; Install: POP; Min Operating Temperature: -55°C; Tolerance: 1%; Length: 0.039inch; Case/Package: 0402; Case Code (Metric): 1005; Series: RC; Max Operating Temperature: 155°C; Termination: SMD/SMT; Contact Plating: Tin,Lead; Height: 0.016inch; Packaging: Tape and Reel; RoHS Compliant: Yes; Lead Free: Lead Free; Number of Terminations: 2; Case Code (Imperial): 0402; Features: Moisture Resistant; Width: 0.5mm
R74 = CMP-00319-1: RES 0 OHM JUMPER 1/16W 0402; Max Power Dissipation: 63mW; Working Voltage: 50V; Current Rating: 1A; Case/Package: 0402; Max Operating Temperature: 155°C; Contact Plating: Tin,Matte; Height: 0.016inch; RoHS Compliant: Yes; Lead Free: Lead Free; Length: 0.039inch; Case Code (Imperial): 0402; Resistor Type: Thick Film; Military Standard: Not; Width: 0.02inch; Construction: Rectangular; Features: Automotive AEC-Q200; Depth: 0.5mm; Case Code (Metric): 1005; Technology: THICK FILM; Number of Terminations: 2; Power Rating: 63mW; Radiation Hardening: No; Min Operating Temperature: -55°C; Series: RMCF; Packaging: Tape and Reel; Mount: Surface Mount
R75 = CMP-00973-2: RC FIXED RESISTOR 0402 (1005Metric) Chip Resistor ±1% ±100ppm/C 619kOhm 0.063W 1/16W; Max Power Dissipation: 63mW; Voltage Rating: 50V; Power Rating: 62.5mW; Temperature Coefficient: 100ppm/°C; Install: POP; Features: Moisture Resistant; Lead Free: Lead Free; Case Code (Metric): 1005; Length: 1mm; Construction: Rectangular; Min Operating Temperature: -55°C; Packaging: Tape and Reel; Series: RC; Tolerance: 1%; Termination: SMD/SMT; Military Standard: Not; Depth: 0.5mm; Case/Package: 0402; Case Code (Imperial): 0402; Max Operating Temperature: 155°C; Number of Terminations: 2; Contact Plating: Tin,Lead; RoHS Compliant: Yes; Width: 0.5mm; Height: 0.016inch
R76 = CMP-00974-2: SMD Chip Resistor, 137 kOhm, ± 1%, 63 mW, 0402 [1005 Metric], Thick Film, General Purpose; Max Power Dissipation: 63mW; Working Voltage: 50V; Power Rating: 62.5mW; Temperature Coefficient: 100ppm/°C; Install: POP; Case/Package: 0402; Width: 0.5mm; Length: 0.039inch; Contact Plating: Tin,Matte; Termination: SMD/SMT; Case Code (Imperial): 0402; Series: RC; Features: Moisture Resistant; RoHS Compliant: Yes; Voltage Rating: 50V; Min Operating Temperature: -55°C; Case Code (Metric): 1005; Number of Terminations: 2; Height: 0.016inch; Tolerance: 1%; Lead Free: Lead Free; Technology: THICK FILM; Max Operating Temperature: 155°C; Packaging: Tape and Reel
TP11 TP18-TP23 TP29 = CMP-00021-4: Test Point Circle 30; Install: DNP
U7 = CMP-00928-3: IC REG BOOST ADJ 10A SYNC 20VQFN; Quiescent Current: 110uA; Efficiency: 91%; Install: POP; Switching Frequency: 2.2MHz; Max Output Voltage: 12.6V; Synchronous Rectifier: Yes; Output Type: Adjustable; Max Supply Voltage: 12V; Output Configuration: Positive; Min Input Voltage: 2.7V; Min Output Voltage: 4.5V; Number of Outputs: 1; Mounting Technology: Surface Mount; Output Current: 10A; Packaging: Cut Tape; Case/Package: VQFN; Lead Free: Lead Free; Output Voltage: 12.6V; Min Operating Temperature: -40°C; RoHS Compliant: Yes; Topology: Boost; Operating Supply Voltage: 12V; Max Operating Temperature: 85°C; Series: -; Pins: 20; Max Output current: 10A
U13 = CMP-00971-5: 3-V to 17-V, 1-A, high-efficiency, low-IQ, synchronous buck converter in SOT-583 package 8-SOT-5X3 -40 to 150; Install: POP
U15 = CMP-00215-5: IC LOAD SWITCH W/DIS 1.5A 4WLCSP; On-State Resistance: 400mR; Turn-On Delay Time: 195us; Install: POP; Power Dissipation: 400mW; Number of Outputs: 1; Output Configuration: High Side; Operating Supply Voltage: 5.5V; Interface: On/Off; Packaging: Tape and Reel; Max Supply Current: 1.5A; Number of Pins: 4; Package Quantity: 3000; Max Operating Temperature: 85°C; RoHS Compliant: Yes; Min Operating Temperature: -40°C; Lead Free: Lead Free; Output Current: 1.5A; Max Power Dissipation: 400mW; Mount: Surface Mount; Series: -; Max Output Current: 1.5A; Halogen Free: Halogen Free
U16 = CMP-00935-3: 6A/4A, 50-V, 2.2-MHz wide VIN boost, flyback, & SEPIC converter with dual random spread spectrum 16-WQFN -40 to 125; Install: POP